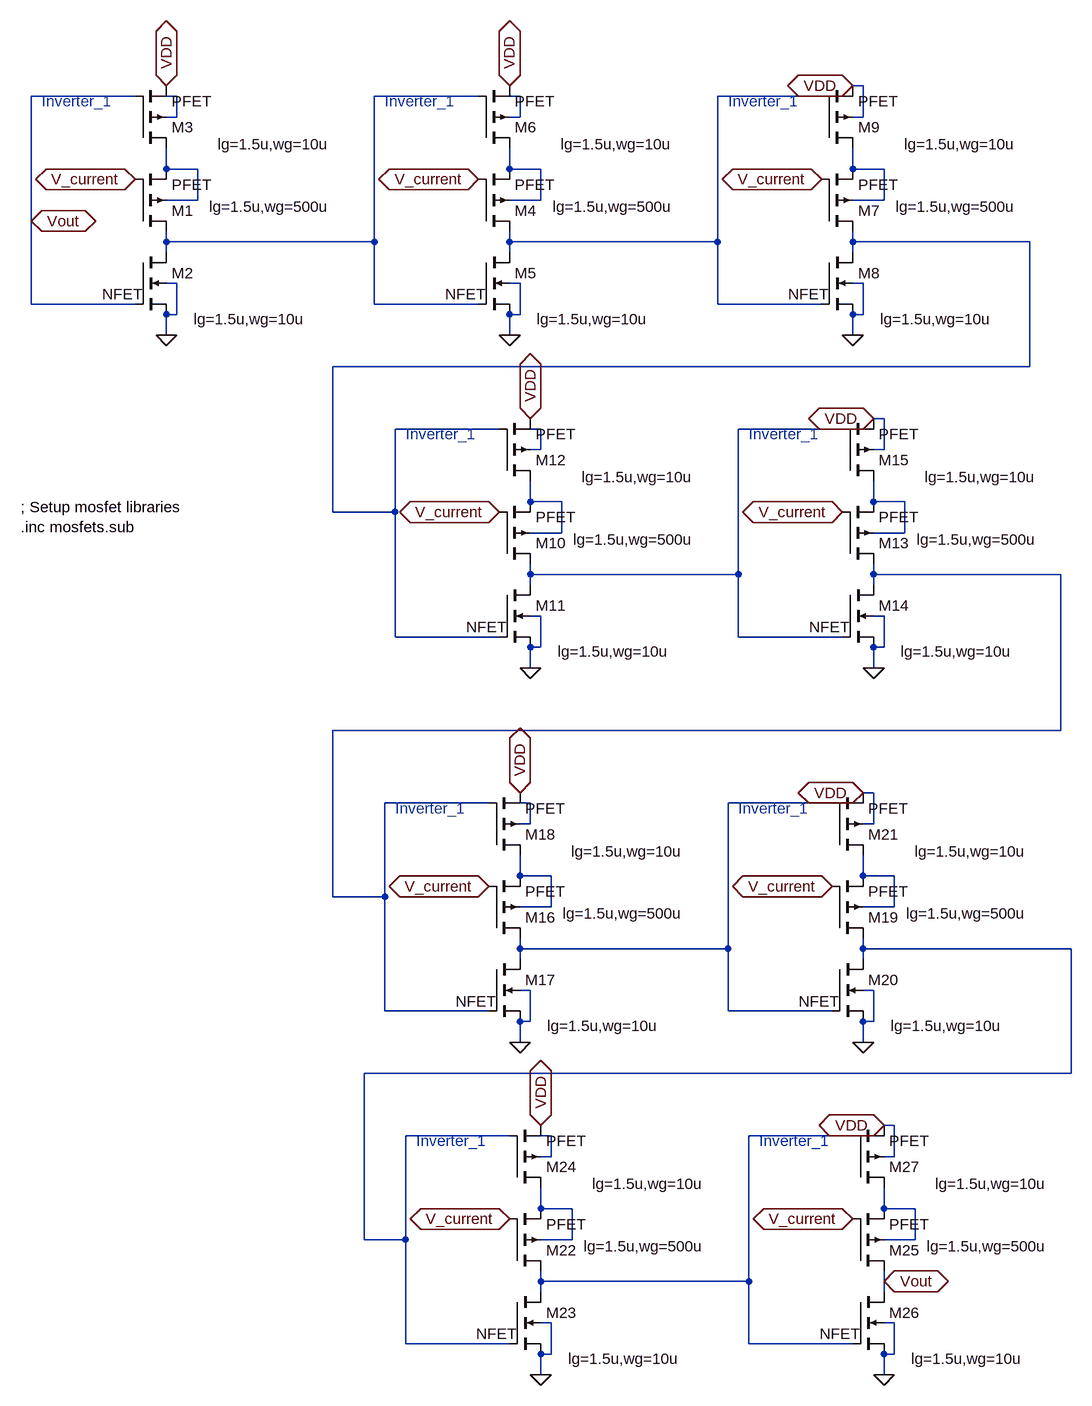
[diagram p0: schematic 2_oscillator_winterg.asc]
2_oscillator_winterg.asc, the LTspice schematic file:
Version 4
SHEET 1 2644 1360
WIRE 896 -640 880 -640
WIRE -224 -624 -384 -624
WIRE -160 -624 -176 -624
WIRE 304 -624 144 -624
WIRE 352 -624 352 -640
WIRE 368 -624 352 -624
WIRE 832 -624 672 -624
WIRE -160 -592 -160 -624
WIRE -160 -592 -176 -592
WIRE 368 -592 368 -624
WIRE 368 -592 352 -592
WIRE 896 -592 896 -640
WIRE 896 -592 880 -592
WIRE -176 -512 -176 -544
WIRE -128 -512 -176 -512
WIRE 352 -512 352 -544
WIRE 400 -512 352 -512
WIRE 880 -512 880 -544
WIRE 928 -512 880 -512
WIRE -128 -464 -128 -512
WIRE -128 -464 -176 -464
WIRE 400 -464 400 -512
WIRE 400 -464 352 -464
WIRE 928 -464 928 -512
WIRE 928 -464 880 -464
WIRE -384 -432 -384 -624
WIRE -176 -400 -176 -416
WIRE 144 -400 144 -624
WIRE 144 -400 -176 -400
WIRE 352 -400 352 -416
WIRE 672 -400 672 -624
WIRE 672 -400 352 -400
WIRE 880 -400 880 -416
WIRE 1152 -400 880 -400
WIRE -176 -384 -176 -400
WIRE 352 -384 352 -400
WIRE 880 -384 880 -400
WIRE -160 -336 -176 -336
WIRE 368 -336 352 -336
WIRE 896 -336 880 -336
WIRE -384 -304 -384 -432
WIRE -224 -304 -384 -304
WIRE 144 -304 144 -400
WIRE 304 -304 144 -304
WIRE 672 -304 672 -400
WIRE 832 -304 672 -304
WIRE -160 -288 -160 -336
WIRE -160 -288 -176 -288
WIRE 368 -288 368 -336
WIRE 368 -288 352 -288
WIRE 896 -288 896 -336
WIRE 896 -288 880 -288
WIRE -176 -256 -176 -288
WIRE 352 -256 352 -288
WIRE 880 -256 880 -288
WIRE 1152 -208 1152 -400
WIRE 1152 -208 80 -208
WIRE 928 -128 912 -128
WIRE 336 -112 176 -112
WIRE 384 -112 384 -128
WIRE 400 -112 384 -112
WIRE 864 -112 704 -112
WIRE 400 -80 400 -112
WIRE 400 -80 384 -80
WIRE 928 -80 928 -128
WIRE 928 -80 912 -80
WIRE 384 0 384 -32
WIRE 432 0 384 0
WIRE 912 0 912 -32
WIRE 960 0 912 0
WIRE 80 16 80 -208
WIRE 176 16 176 -112
WIRE 176 16 80 16
WIRE 432 48 432 0
WIRE 432 48 384 48
WIRE 960 48 960 0
WIRE 960 48 912 48
WIRE 384 112 384 96
WIRE 704 112 704 -112
WIRE 704 112 384 112
WIRE 912 112 912 96
WIRE 1200 112 912 112
WIRE 384 128 384 112
WIRE 912 128 912 112
WIRE 400 176 384 176
WIRE 928 176 912 176
WIRE 176 208 176 16
WIRE 336 208 176 208
WIRE 704 208 704 112
WIRE 864 208 704 208
WIRE 400 224 400 176
WIRE 400 224 384 224
WIRE 928 224 928 176
WIRE 928 224 912 224
WIRE 384 256 384 224
WIRE 912 256 912 224
WIRE 1200 352 1200 112
WIRE 1200 352 80 352
WIRE 912 448 896 448
WIRE 320 464 160 464
WIRE 368 464 368 448
WIRE 384 464 368 464
WIRE 848 464 688 464
WIRE 384 496 384 464
WIRE 384 496 368 496
WIRE 912 496 912 448
WIRE 912 496 896 496
WIRE 368 576 368 544
WIRE 416 576 368 576
WIRE 896 576 896 544
WIRE 944 576 896 576
WIRE 80 608 80 352
WIRE 160 608 160 464
WIRE 160 608 80 608
WIRE 416 624 416 576
WIRE 416 624 368 624
WIRE 944 624 944 576
WIRE 944 624 896 624
WIRE 368 688 368 672
WIRE 688 688 688 464
WIRE 688 688 368 688
WIRE 896 688 896 672
WIRE 1216 688 896 688
WIRE 368 704 368 688
WIRE 896 704 896 688
WIRE 384 752 368 752
WIRE 912 752 896 752
WIRE 160 784 160 608
WIRE 320 784 160 784
WIRE 688 784 688 688
WIRE 848 784 688 784
WIRE 384 800 384 752
WIRE 384 800 368 800
WIRE 912 800 912 752
WIRE 912 800 896 800
WIRE 368 832 368 800
WIRE 896 832 896 800
WIRE 1216 880 1216 688
WIRE 1216 880 128 880
WIRE 944 960 928 960
WIRE 352 976 192 976
WIRE 400 976 400 960
WIRE 416 976 400 976
WIRE 880 976 720 976
WIRE 416 1008 416 976
WIRE 416 1008 400 1008
WIRE 944 1008 944 960
WIRE 944 1008 928 1008
WIRE 400 1088 400 1056
WIRE 448 1088 400 1088
WIRE 928 1088 928 1056
WIRE 976 1088 928 1088
WIRE 128 1136 128 880
WIRE 192 1136 192 976
WIRE 192 1136 128 1136
WIRE 448 1136 448 1088
WIRE 448 1136 400 1136
WIRE 976 1136 976 1088
WIRE 976 1136 928 1136
WIRE 400 1200 400 1184
WIRE 720 1200 720 976
WIRE 720 1200 400 1200
WIRE 928 1200 928 1184
WIRE 400 1216 400 1200
WIRE 928 1216 928 1200
WIRE 416 1264 400 1264
WIRE 944 1264 928 1264
WIRE 192 1296 192 1136
WIRE 352 1296 192 1296
WIRE 720 1296 720 1200
WIRE 880 1296 720 1296
WIRE 416 1312 416 1264
WIRE 416 1312 400 1312
WIRE 944 1312 944 1264
WIRE 944 1312 928 1312
WIRE 400 1344 400 1312
WIRE 928 1344 928 1312
FLAG -176 -256 0
FLAG -176 -640 VDD
IOPIN -176 -640 BiDir
FLAG -224 -496 V_current
IOPIN -224 -496 BiDir
FLAG -384 -432 Vout
IOPIN -384 -432 BiDir
FLAG 352 -256 0
FLAG 352 -640 VDD
IOPIN 352 -640 BiDir
FLAG 304 -496 V_current
IOPIN 304 -496 BiDir
FLAG 880 -256 0
FLAG 880 -640 VDD
IOPIN 880 -640 BiDir
FLAG 832 -496 V_current
IOPIN 832 -496 BiDir
FLAG 384 256 0
FLAG 384 -128 VDD
IOPIN 384 -128 BiDir
FLAG 336 16 V_current
IOPIN 336 16 BiDir
FLAG 912 256 0
FLAG 912 -128 VDD
IOPIN 912 -128 BiDir
FLAG 864 16 V_current
IOPIN 864 16 BiDir
FLAG 368 832 0
FLAG 368 448 VDD
IOPIN 368 448 BiDir
FLAG 320 592 V_current
IOPIN 320 592 BiDir
FLAG 896 832 0
FLAG 896 448 VDD
IOPIN 896 448 BiDir
FLAG 848 592 V_current
IOPIN 848 592 BiDir
FLAG 928 1200 Vout
IOPIN 928 1200 BiDir
FLAG 400 1344 0
FLAG 400 960 VDD
IOPIN 400 960 BiDir
FLAG 352 1104 V_current
IOPIN 352 1104 BiDir
FLAG 928 1344 0
FLAG 928 960 VDD
IOPIN 928 960 BiDir
FLAG 880 1104 V_current
IOPIN 880 1104 BiDir
SYMBOL pmos4 -224 -416 M180
WINDOW 123 114 38 Left 2
SYMATTR Value2 lg=1.5u,wg=500u
SYMATTR InstName M1
SYMATTR Value PFET
SYMATTR Prefix X
SYMBOL nmos4 -224 -384 R0
WINDOW 123 90 103 Left 2
WINDOW 3 -51 65 Left 2
SYMATTR Value2 lg=1.5u,wg=10u
SYMATTR Value NFET
SYMATTR InstName M2
SYMATTR Prefix X
SYMBOL pmos4 -224 -544 M180
WINDOW 123 127 6 Left 2
SYMATTR Value2 lg=1.5u,wg=10u
SYMATTR InstName M3
SYMATTR Value PFET
SYMATTR Prefix X
SYMBOL pmos4 304 -416 M180
WINDOW 123 114 38 Left 2
SYMATTR Value2 lg=1.5u,wg=500u
SYMATTR InstName M4
SYMATTR Value PFET
SYMATTR Prefix X
SYMBOL nmos4 304 -384 R0
WINDOW 123 90 103 Left 2
WINDOW 3 -51 65 Left 2
SYMATTR Value2 lg=1.5u,wg=10u
SYMATTR Value NFET
SYMATTR InstName M5
SYMATTR Prefix X
SYMBOL pmos4 304 -544 M180
WINDOW 123 127 6 Left 2
SYMATTR Value2 lg=1.5u,wg=10u
SYMATTR InstName M6
SYMATTR Value PFET
SYMATTR Prefix X
SYMBOL pmos4 832 -416 M180
WINDOW 123 114 38 Left 2
SYMATTR Value2 lg=1.5u,wg=500u
SYMATTR InstName M7
SYMATTR Value PFET
SYMATTR Prefix X
SYMBOL nmos4 832 -384 R0
WINDOW 123 90 103 Left 2
WINDOW 3 -51 65 Left 2
SYMATTR Value2 lg=1.5u,wg=10u
SYMATTR Value NFET
SYMATTR InstName M8
SYMATTR Prefix X
SYMBOL pmos4 832 -544 M180
WINDOW 123 127 6 Left 2
SYMATTR Value2 lg=1.5u,wg=10u
SYMATTR InstName M9
SYMATTR Value PFET
SYMATTR Prefix X
SYMBOL pmos4 336 96 M180
WINDOW 123 114 38 Left 2
SYMATTR Value2 lg=1.5u,wg=500u
SYMATTR InstName M10
SYMATTR Value PFET
SYMATTR Prefix X
SYMBOL nmos4 336 128 R0
WINDOW 123 90 103 Left 2
WINDOW 3 -51 65 Left 2
SYMATTR Value2 lg=1.5u,wg=10u
SYMATTR Value NFET
SYMATTR InstName M11
SYMATTR Prefix X
SYMBOL pmos4 336 -32 M180
WINDOW 123 127 6 Left 2
SYMATTR Value2 lg=1.5u,wg=10u
SYMATTR InstName M12
SYMATTR Value PFET
SYMATTR Prefix X
SYMBOL pmos4 864 96 M180
WINDOW 123 114 38 Left 2
SYMATTR Value2 lg=1.5u,wg=500u
SYMATTR InstName M13
SYMATTR Value PFET
SYMATTR Prefix X
SYMBOL nmos4 864 128 R0
WINDOW 123 90 103 Left 2
WINDOW 3 -51 65 Left 2
SYMATTR Value2 lg=1.5u,wg=10u
SYMATTR Value NFET
SYMATTR InstName M14
SYMATTR Prefix X
SYMBOL pmos4 864 -32 M180
WINDOW 123 127 6 Left 2
SYMATTR Value2 lg=1.5u,wg=10u
SYMATTR InstName M15
SYMATTR Value PFET
SYMATTR Prefix X
SYMBOL pmos4 320 672 M180
WINDOW 123 114 38 Left 2
SYMATTR Value2 lg=1.5u,wg=500u
SYMATTR InstName M16
SYMATTR Value PFET
SYMATTR Prefix X
SYMBOL nmos4 320 704 R0
WINDOW 123 90 103 Left 2
WINDOW 3 -51 65 Left 2
SYMATTR Value2 lg=1.5u,wg=10u
SYMATTR Value NFET
SYMATTR InstName M17
SYMATTR Prefix X
SYMBOL pmos4 320 544 M180
WINDOW 123 127 6 Left 2
SYMATTR Value2 lg=1.5u,wg=10u
SYMATTR InstName M18
SYMATTR Value PFET
SYMATTR Prefix X
SYMBOL pmos4 848 672 M180
WINDOW 123 114 38 Left 2
SYMATTR Value2 lg=1.5u,wg=500u
SYMATTR InstName M19
SYMATTR Value PFET
SYMATTR Prefix X
SYMBOL nmos4 848 704 R0
WINDOW 123 90 103 Left 2
WINDOW 3 -51 65 Left 2
SYMATTR Value2 lg=1.5u,wg=10u
SYMATTR Value NFET
SYMATTR InstName M20
SYMATTR Prefix X
SYMBOL pmos4 848 544 M180
WINDOW 123 127 6 Left 2
SYMATTR Value2 lg=1.5u,wg=10u
SYMATTR InstName M21
SYMATTR Value PFET
SYMATTR Prefix X
SYMBOL pmos4 352 1184 M180
WINDOW 123 114 38 Left 2
SYMATTR Value2 lg=1.5u,wg=500u
SYMATTR InstName M22
SYMATTR Value PFET
SYMATTR Prefix X
SYMBOL nmos4 352 1216 R0
WINDOW 123 90 103 Left 2
WINDOW 3 -51 65 Left 2
SYMATTR Value2 lg=1.5u,wg=10u
SYMATTR Value NFET
SYMATTR InstName M23
SYMATTR Prefix X
SYMBOL pmos4 352 1056 M180
WINDOW 123 127 6 Left 2
SYMATTR Value2 lg=1.5u,wg=10u
SYMATTR InstName M24
SYMATTR Value PFET
SYMATTR Prefix X
SYMBOL pmos4 880 1184 M180
WINDOW 123 114 38 Left 2
SYMATTR Value2 lg=1.5u,wg=500u
SYMATTR InstName M25
SYMATTR Value PFET
SYMATTR Prefix X
SYMBOL nmos4 880 1216 R0
WINDOW 123 90 103 Left 2
WINDOW 3 -51 65 Left 2
SYMATTR Value2 lg=1.5u,wg=10u
SYMATTR Value NFET
SYMATTR InstName M26
SYMATTR Prefix X
SYMBOL pmos4 880 1056 M180
WINDOW 123 127 6 Left 2
SYMATTR Value2 lg=1.5u,wg=10u
SYMATTR InstName M27
SYMATTR Value PFET
SYMATTR Prefix X
TEXT -400 8 Left 2 !; Setup mosfet libraries\n.inc mosfets.sub
TEXT -368 -616 Left 2 ;Inverter_1
TEXT 160 -616 Left 2 ;Inverter_1
TEXT 688 -616 Left 2 ;Inverter_1
TEXT 192 -104 Left 2 ;Inverter_1
TEXT 720 -104 Left 2 ;Inverter_1
TEXT 176 472 Left 2 ;Inverter_1
TEXT 704 472 Left 2 ;Inverter_1
TEXT 208 984 Left 2 ;Inverter_1
TEXT 736 984 Left 2 ;Inverter_1

The netlist it stands for:
* 2_oscillator_winterg.asc
XM1 N002 V_current N004 N004 PFET lg=1.5u,wg=500u  ; pins D G S B
XM2 N002 Vout 0 0 NFET lg=1.5u,wg=10u  ; pins D G S B
XM3 N004 Vout VDD N001 PFET lg=1.5u,wg=10u  ; pins D G S B
XM4 N003 V_current N005 N005 PFET lg=1.5u,wg=500u  ; pins D G S B
XM5 N003 N002 0 0 NFET lg=1.5u,wg=10u  ; pins D G S B
XM6 N005 N002 VDD VDD PFET lg=1.5u,wg=10u  ; pins D G S B
XM7 N007 V_current N006 N006 PFET lg=1.5u,wg=500u  ; pins D G S B
XM8 N007 N003 0 0 NFET lg=1.5u,wg=10u  ; pins D G S B
XM9 N006 N003 VDD VDD PFET lg=1.5u,wg=10u  ; pins D G S B
XM10 N008 V_current N009 N009 PFET lg=1.5u,wg=500u  ; pins D G S B
XM11 N008 N007 0 0 NFET lg=1.5u,wg=10u  ; pins D G S B
XM12 N009 N007 VDD VDD PFET lg=1.5u,wg=10u  ; pins D G S B
XM13 N011 V_current N010 N010 PFET lg=1.5u,wg=500u  ; pins D G S B
XM14 N011 N008 0 0 NFET lg=1.5u,wg=10u  ; pins D G S B
XM15 N010 N008 VDD VDD PFET lg=1.5u,wg=10u  ; pins D G S B
XM16 N012 V_current N013 N013 PFET lg=1.5u,wg=500u  ; pins D G S B
XM17 N012 N011 0 0 NFET lg=1.5u,wg=10u  ; pins D G S B
XM18 N013 N011 VDD VDD PFET lg=1.5u,wg=10u  ; pins D G S B
XM19 N015 V_current N014 N014 PFET lg=1.5u,wg=500u  ; pins D G S B
XM20 N015 N012 0 0 NFET lg=1.5u,wg=10u  ; pins D G S B
XM21 N014 N012 VDD VDD PFET lg=1.5u,wg=10u  ; pins D G S B
XM22 N016 V_current N017 N017 PFET lg=1.5u,wg=500u  ; pins D G S B
XM23 N016 N015 0 0 NFET lg=1.5u,wg=10u  ; pins D G S B
XM24 N017 N015 VDD VDD PFET lg=1.5u,wg=10u  ; pins D G S B
XM25 Vout V_current N018 N018 PFET lg=1.5u,wg=500u  ; pins D G S B
XM26 Vout N016 0 0 NFET lg=1.5u,wg=10u  ; pins D G S B
XM27 N018 N016 VDD VDD PFET lg=1.5u,wg=10u  ; pins D G S B
; Setup mosfet libraries
.inc mosfets.sub
* Inverter_1
* Inverter_1
* Inverter_1
* Inverter_1
* Inverter_1
* Inverter_1
* Inverter_1
* Inverter_1
* Inverter_1
.backanno
.end